# EasyEDA Pro project PrototypeBoardV1B.eprj

# Schematic Schematic1
Board Name: Board1; Create Date: 2025-06-25; Page Name: P1; Project Name: PrototypeBoardV1B; Schematic Name: Schematic1; Update Date: 2025-08-24; Company: m039; Drawn: Dmitry Mozgin; Page Size: A4; Version: V1.0
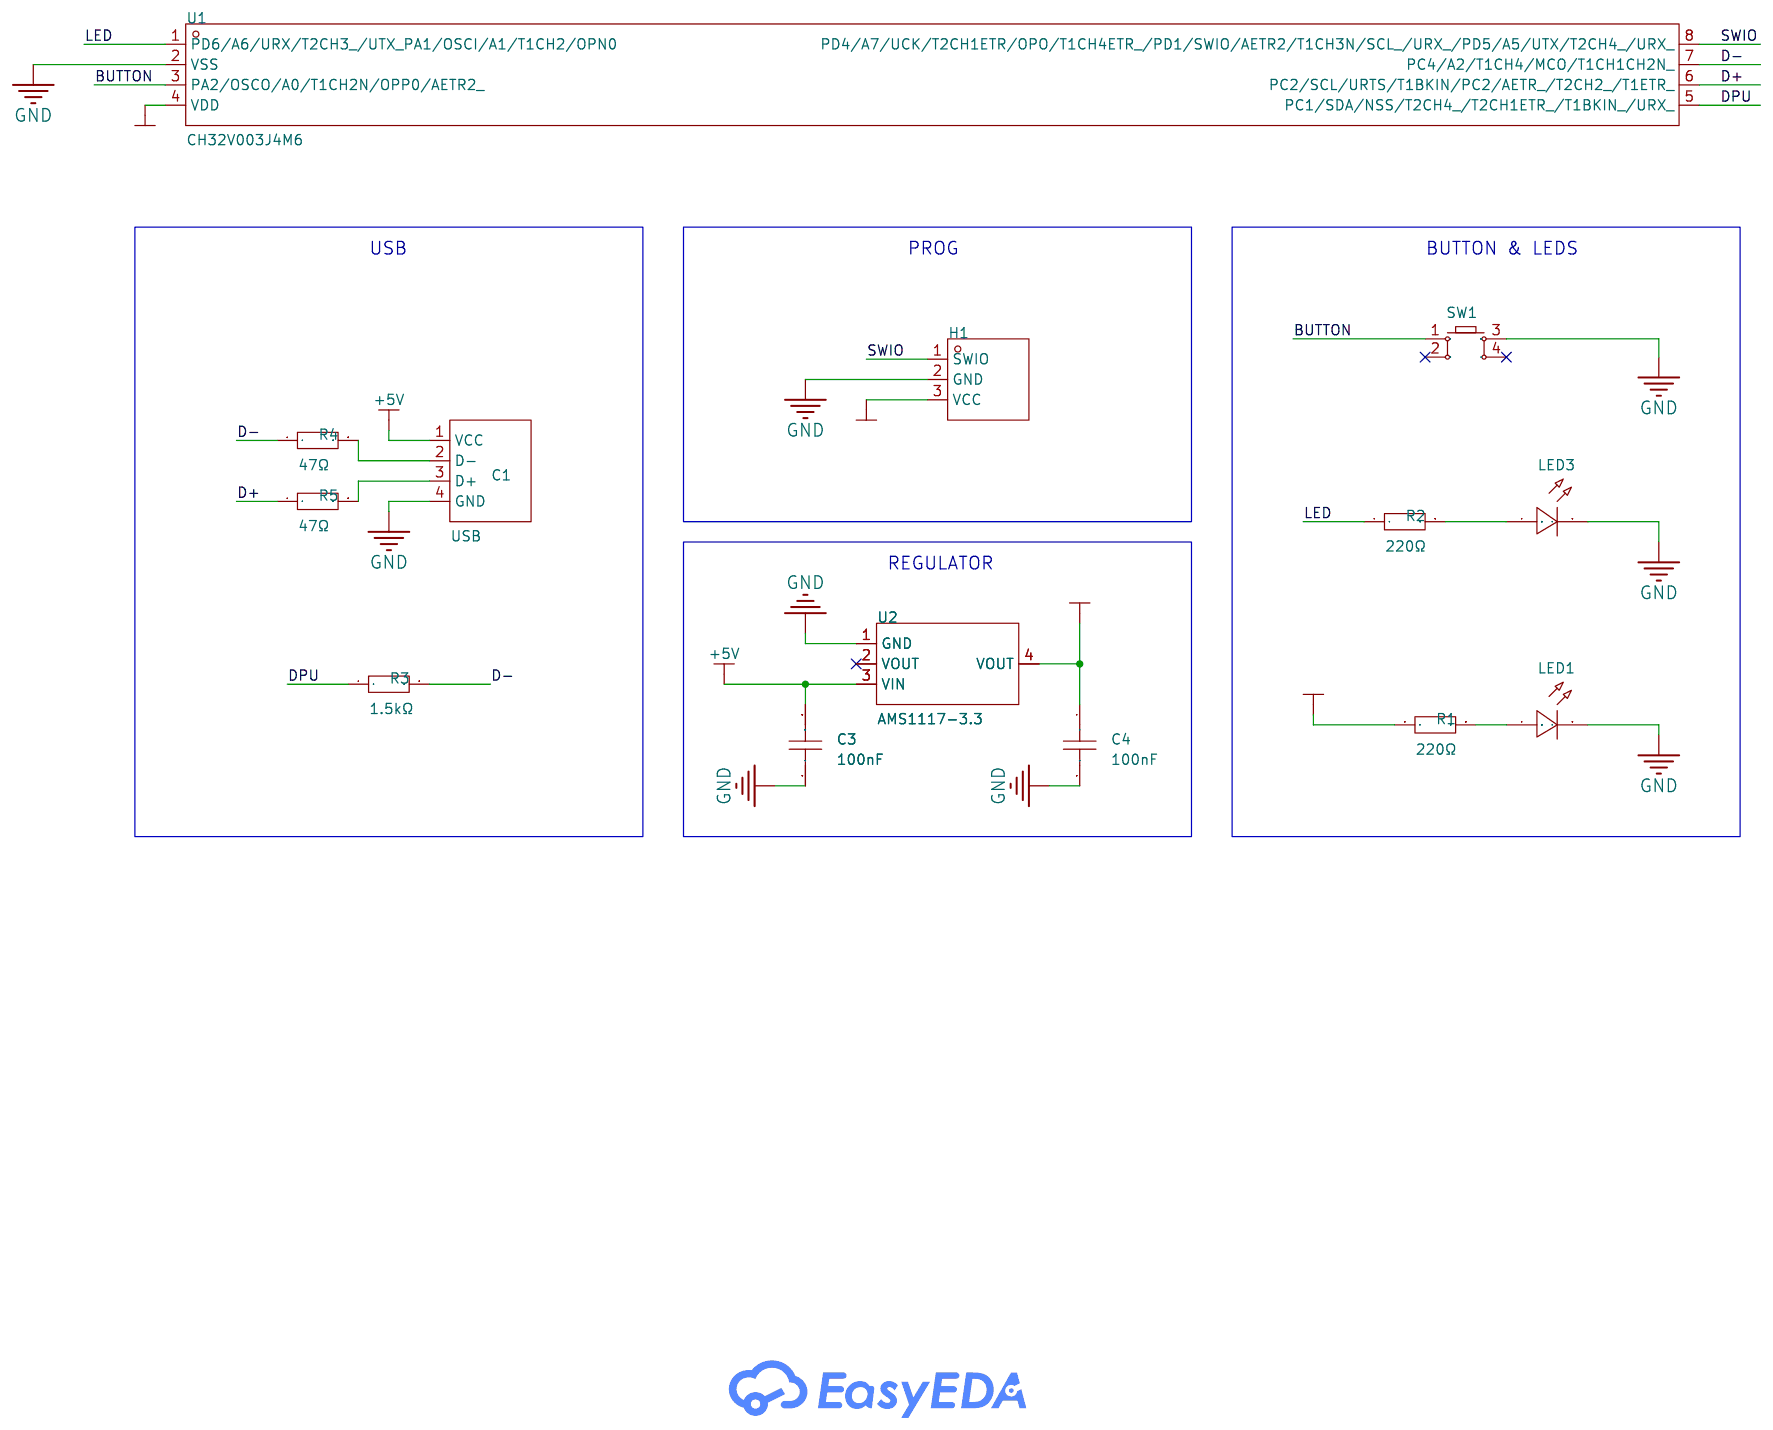
[diagram p0: schematic sheet]

## Parts
C1  USB  [USB Type-C 4P]
C3  100nF  [CAP-TH_L5.8-W3.0-P4.7-D0.45]
C4  100nF  [CAP-TH_L5.8-W3.0-P4.7-D0.45]
H1  -  [HDR-TH_3P-P2.54-V-M]
LED1  -  [LED-TH_BD3.0-P2.54-FD]
LED3  -  [LED-TH_BD3.8-P2.54-FD_BLUE]
R1  220Ω  [RES-TH_BD1.8-L3.2-P7.20-D0.4]
R2  220Ω  [RES-TH_BD1.8-L3.2-P7.20-D0.4]
R3  1.5kΩ  [RES-TH_BD1.8-L3.2-P7.20-D0.4]
R4  47Ω  [RES-TH_BD1.8-L3.2-P7.20-D0.4]
R5  47Ω  [RES-TH_BD1.8-L3.2-P7.20-D0.4]
SW1  -  [KEY-TH_4P-L6.0-W6.0-P3.90-LS6.5]
U1  CH32V003J4M6  [SOP-8_L4.9-W3.8-P1.27-LS6.0-BL]
U2  AMS1117-3.3  [SOT-223-3_L6.5-W3.4-P2.30-LS7.0-BR]

## Library data of the parts
C1 = USB Type-C 4P Board
C3 C4 = 1C10Z5U104M050B: LCSC Part Name: 100nF ±20% 50V; Supplier Part: C3009699; Manufacturer: VISHAY(威世); Supplier Footprint: 插件,P=10mm; JLCPCB Part Class: Extended Part; Datasheet: https://atta.szlcsc.com/upload/public/pdf/source/20210701/0CF1A7AD3406E72B391D35880AF61B15.pdf; Supplier: LCSC; Tolerance: ±20%; Voltage Rating: 50V; Pin Spacing: 2.54mm; Temperature Coefficient: Z5U; Diameter: 5.08mm; Body Thickness: 3.18mm
H1 = HDR-M_2.54_1x3P: Supplier Footprint: Through
LED1 = LED_TH-R_3mm: Supplier Footprint: Through
LED3 = LED_TH-B_3mm: Supplier Footprint: Through
R1-R5 = Res_AXIAL-1/8W: Supplier Footprint: Through
SW1 = Key_TH_6x6x4.5: Supplier Footprint: Through
U1 = CH32V003J4M6_C5346354: Supplier Part: C5346354; Manufacturer: WCH(南京沁恒); Supplier Footprint: SOP-8; JLCPCB Part Class: Extended Part; Datasheet: https://atta.szlcsc.com/upload/public/pdf/source/20240313/8FAFD0DE100342130E64AE37B01CD8FD.pdf; Supplier: LCSC
U2 = AMS1117-3.3_C6186: LCSC Part Name: 输出3.3V 1A; Supplier Part: C6186; Manufacturer: AMS; Supplier Footprint: SOT-223; JLCPCB Part Class: Basic Part; Datasheet: https://atta.szlcsc.com/upload/public/pdf/source/20180727/C6186_7A095716F0823C02F1997A905E26C086.pdf; Supplier: LCSC; Output Type: Fixed; Voltage - Supply: 16V; Output Voltage: 3.3V; Output Current: 1A; Power Supply Rejection Ratio (PSRR): 72dB@(120Hz); Voltage Dropout: 1.1V@(800mA); standby current: 5mA; Features: Over Current Protection；Over Temperature Protection; Operating Temperature: -40℃~+125℃; Output Configuration: Positive; Number of Outputs: 1

## Nets
+3.3V: C4.1 H1.3(VCC) R1.1 U1.4(VDD) U2.4(VOUT)
+5V: C1.1(VCC) C3.2 U2.3(VIN)
GND: C1.4(GND) C3.1 C4.2 H1.2(GND) LED1.2(A) LED3.2(A) SW1.3 U1.2(VSS) U2.1(GND)
BUTTON: SW1.1 U1.3(PA2/OSCO/A0/T1CH2N/OPP0/AETR2_)
D+: R5.1 U1.6(PC2/SCL/URTS/T1BKIN/PC2/AETR_/T2CH2_/T1ETR_)
D-: R3.2 R4.1 U1.7(PC4/A2/T1CH4/MCO/T1CH1CH2N_)
DPU: R3.1 U1.5(PC1/SDA/NSS/T2CH4_/T2CH1ETR_/T1BKIN_/URX_)
LED: R2.1 U1.1(PD6/A6/URX/T2CH3_/UTX_PA1/OSCI/A1/T1CH2/OPN0)
SWIO: H1.1(SWIO) U1.8(PD4/A7/UCK/T2CH1ETR/OPO/T1CH4ETR_/PD1/SWIO/AETR2/T1CH3N/SCL_/URX_/PD5/A5/UTX/T2CH4_/URX_)
$1N1276: LED1.1(C) R1.2
$1N2333: LED3.1(C) R2.2
$1N3479: C1.2(D-) R4.2
$1N3509: C1.3(D+) R5.2

Not connected (* = marked no-connect by the designer): SW1 2* 4*; U2 2(VOUT)*

## Notes on the sheet
- USB
- PROG
- BUTTON & LEDS
- REGULATOR

# Board PCB1
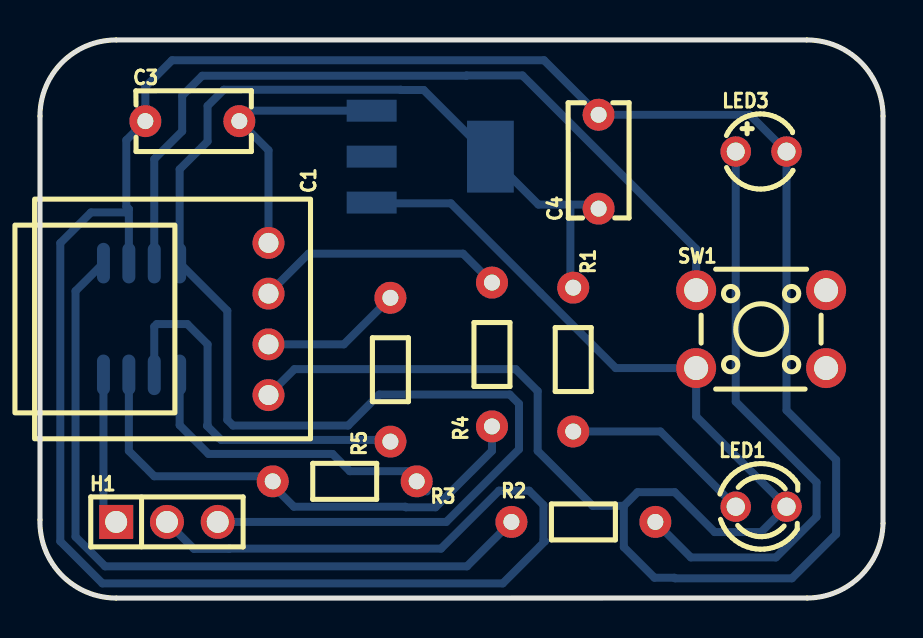
[diagram p1: board, top side]
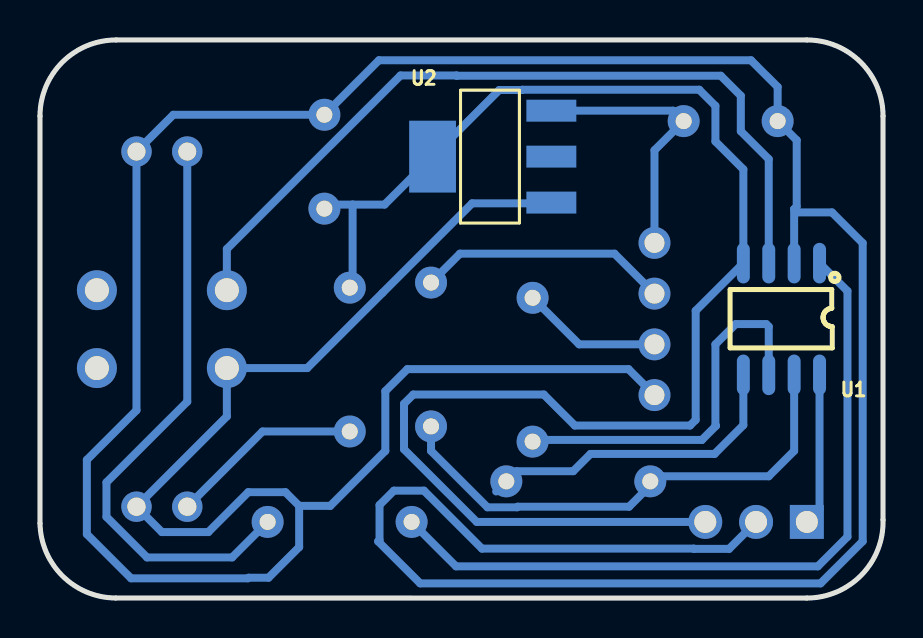
[diagram p2: board, bottom side, seen from below]

Outline 42.16 x 27.94 mm; copper layers: Top Layer, Bottom Layer. Coordinates in mm from the lower left corner of the outline.
Outline path: 0,24.13 0,3.92 arc(1.08,1.15) 3.81,0 38.38,0 arc(41.03,1.1) 42.16,3.74 42.16,24.13 arc(41.05,26.82) 38.35,27.94 3.81,27.94 arc(1.12,26.83) 0,24.13
Stack: Top Layer 0.035mm / Dielectric1 1.51mm FR4 er 4.5 / Bottom Layer 0.035mm

## Design rules (mm)
template: Custom Config
spacing copperThickness1oz (default): track to track 0.3, other pairs 0.152 to 0.3
spacing copperThickness2oz: track to track 0.203, other pairs 0.152 to 0.3
track width copperThickness1oz (default): min 0.127, default 0.4, max 2.54
track width copperThickness2oz: min 0.203, default 0.254, max 2.54
differential pair differentialPair (default): width min 0.127, default 0.254, max 2.54; gap min 0.152, default 0.152
via viaSize (default): diameter min 0.5, default 0.61, max 10; hole min 0.3, default 0.305, max 6.3

## Placement (name value [footprint] x y rotation side)
C1  USB  [USB Type-C 4P]  11.43 13.97 270 top
C3  100nF  [CAP-TH_L5.8-W3.0-P4.7-D0.45]  7.62 23.88 0 top
C4  100nF  [CAP-TH_L5.8-W3.0-P4.7-D0.45]  27.94 21.85 90 top
H1  -  [HDR-TH_3P-P2.54-V-M]  6.35 3.81 0 top
LED1  -  [LED-TH_BD3.0-P2.54-FD]  36.07 4.57 0 top
LED3  -  [LED-TH_BD3.8-P2.54-FD_BLUE]  36.07 22.35 0 top
R1  220Ω  [RES-TH_BD1.8-L3.2-P7.20-D0.4]  26.67 11.94 270 top
R2  220Ω  [RES-TH_BD1.8-L3.2-P7.20-D0.4]  27.18 3.81 0 top
R3  1.5kΩ  [RES-TH_BD1.8-L3.2-P7.20-D0.4]  15.24 5.84 180 top
R4  47Ω  [RES-TH_BD1.8-L3.2-P7.20-D0.4]  22.61 12.19 90 top
R5  47Ω  [RES-TH_BD1.8-L3.2-P7.20-D0.4]  17.53 11.43 90 top
SW1  -  [KEY-TH_4P-L6.0-W6.0-P3.90-LS6.5]  36.07 13.46 0 top
U1  CH32V003J4M6  [SOP-8_L4.9-W3.8-P1.27-LS6.0-BL]  5.08 13.97 0 bottom
U2  AMS1117-3.3  [SOT-223-3_L6.5-W3.4-P2.30-LS7.0-BR]  19.56 22.1 180 bottom

## Footprints (pads in the part's own frame, mm; a bottom-side part is the same pattern mirrored in y, then rotated)
CAP-TH_L5.8-W3.0-P4.7-D0.45
  round 1.6 hole 0.8: 1(-2.35,0) 2(2.35,0)
HDR-TH_3P-P2.54-V-M
  rect 1.7x1.7 hole 1.1: 1(-2.54,0)
  round 1.7 hole 1.1: 2(0,0) 3(2.54,0)
KEY-TH_4P-L6.0-W6.0-P3.90-LS6.5
  round 2 hole 1.2: 1(-3.25,1.95) 2(3.25,1.95) 3(-3.25,-1.95) 4(3.25,-1.95)
LED-TH_BD3.0-P2.54-FD
  round 1.524 hole 0.914: 1(-1.27,0) 2(1.27,0)
LED-TH_BD3.8-P2.54-FD_BLUE
  round 1.524 hole 0.9: 1(-1.27,0) 2(1.27,0)
RES-TH_BD1.8-L3.2-P7.20-D0.4
  round 1.6 hole 0.8: 1(-3.6,0) 2(3.6,0)
SOP-8_L4.9-W3.8-P1.27-LS6.0-BL
  oval 0.65x2.032 smd: 1(-1.905,-2.796) 2(-0.635,-2.796) 3(0.635,-2.796) 4(1.905,-2.796) 5(1.905,2.796) 6(0.635,2.796) 7(-0.635,2.796) 8(-1.905,2.796)
SOT-223-3_L6.5-W3.4-P2.30-LS7.0-BR
  rect 2.5x1.1 smd: 1(2.97,-2.3) 2(2.97,0) 3(2.97,2.3)
  rect 2.34x3.6 smd: 4(-2.97,0)
USB Type-C 4P
  round 1.6 hole 1: 1(-3.81,0) 2(-1.27,0) 3(1.27,0) 4(3.81,0)

## Nets
As in the schematic.

Pads without a net: SW1 2 4; U2 2

## Routing (per net, layer and track width the routed paths; a pad name or vN(x,y) marks a point on that pad's centre or on a via; arc(x,y) is an arc through that point)
+3.3V: length 78.3
  Bottom Layer w0.4: C4.1 27.74,19.7 26.53,19.7 ; H1.3 20.32,3.81 23.96,7.45 23.96,9.73 23.49,10.19 16.97,10.19 15.41,8.64 9.65,8.64 9.37,8.92 9.37,14.38 U1.4 6.99,21.46 8.38,22.86 8.38,24.64 9.19,25.45 18.04,25.45 18.06,25.44 19.19,25.44 U2.4 24.93,19.7 26.53,19.7 ; R1.1 26.53,15.68 26.53,19.7
+5V: length 13.5
  Bottom Layer w0.4: U2.3 10.49,24.4 C3.2 11.43,22.42 C1.1
GND: length 207.2
  Bottom Layer w0.4: 4.44,19.47 4.32,19.6 4.32,22.93 C3.1 5.27,25.59 6.6,26.93 25.21,26.93 C4.2 35.5,24.2 LED3.2 37.34,9.4 39.82,6.92 39.82,3.2 37.61,0.99 31.76,0.99 31.73,1.02 30.73,1.02 29.2,2.55 29.2,4.62 ; 4.44,19.47 4.44,16.77 ; 4.44,19.47 4.28,19.31 2.55,19.31 1.02,17.77 1.02,2.84 3.12,0.73 23.15,0.73 25.25,2.84 25.18,2.91 25.18,4.66 24.46,5.38 22.96,5.38 20.06,2.47 9.46,2.47 9.45,2.46 7.7,2.46 H1.2 ; 29.2,4.62 27.64,4.62 24.89,7.37 24.89,10.36 23.79,11.46 12.73,11.46 C1.4 ; 29.2,4.62 29.89,5.3 31.75,5.3 33.74,3.3 36.07,3.3 LED1.2 32.82,9.09 SW1.3 28.8,11.51 20.55,19.76 16.55,19.76 U2.1
BUTTON: length 40.7
  Bottom Layer w0.4: SW1.1 32.82,17.48 24.13,26.16 21.34,26.16 21.32,26.15 8.11,26.15 7.11,25.15 7.11,23.37 5.72,21.98 U1.3
D+: length 19.1
  Bottom Layer w0.4: R5.1 17.44,7.91 9.06,7.91 8.35,8.62 8.38,8.65 8.38,12.7 7.37,13.72 5.84,13.72 5.72,13.59 U1.6
D-: length 25.6
  Bottom Layer w0.4: 4.44,11.18 4.44,7.37 5.72,6.1 11.64,6.1 ; R3.2 11.64,5.63 12.7,4.57 18.27,4.57 18.3,4.54 19.78,4.54 22.61,7.37 R4.1
DPU: length 16.3
  Bottom Layer w0.4: U1.5 6.99,8.66 8.43,7.21 14.63,7.21 15.49,6.35 18.33,6.35 19.35,5.34
LED: length 37.6
  Bottom Layer w0.4: R2.1 21.35,1.59 3.26,1.59 1.78,3.07 1.78,15.37 U1.1
SWIO: length 7.6
  Bottom Layer w0.4: U1.8 3.18,4.45 H1.1
$1N1276: length 9.7
  Bottom Layer w0.4: LED1.1 31.03,8.34 R1.2
$1N2333: length 29.6
  Bottom Layer w0.4: R2.2 32.56,2.03 36.81,2.03 38.84,4.07 38.84,5.79 34.8,9.83 LED3.1
$1N3479: length 12.6
  Bottom Layer w0.4: C1.2 13.43,17.24 21.16,17.24 R4.2
$1N3509: length 7.1
  Bottom Layer w0.4: R5.2 15.2,12.7 C1.3
